# Altium schematic sheet port.SchDoc
size A4
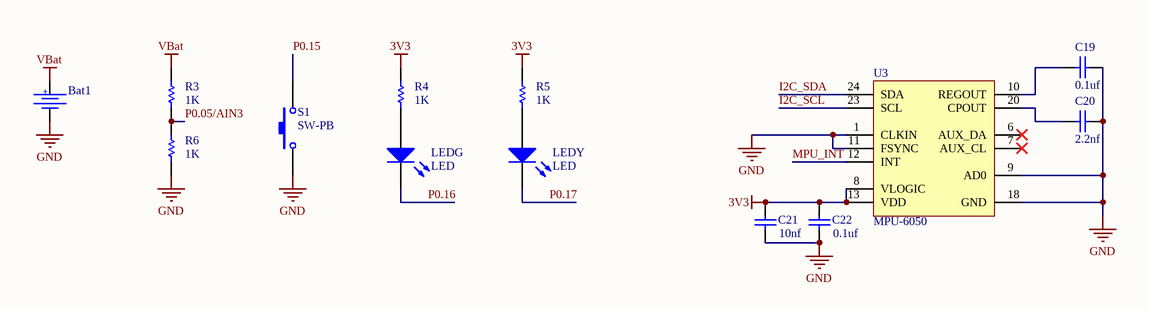
[diagram p0: port.SchDoc]

## Parts
Bat1  Bat Holder CR2032  [HDR1X2]  (value not drawn)
C19  value 0.1uf  [C0603]  (hidden comment: Cap Semi)
C20  value 2.2nf  [C0603]  (hidden comment: Cap Semi)
C21  value 10nf  [C0603]  (hidden comment: Cap Semi)
C22  value 0.1uf  [C0603]  (hidden comment: Cap Semi)
LEDG  LED  [0603]
LEDY  LED  [0603]
R3  value 1K  [R0603-M]  (hidden comment: Resistors SMD)
R4  value 1K  [R0603-M]  (hidden comment: Resistors SMD)
R5  value 1K  [R0603-M]  (hidden comment: Resistors SMD)
R6  value 1K  [R0603-M]  (hidden comment: Resistors SMD)
S1  SW-PB  [SWITCH_SMD_4x3_DHT-1185]
U3  MPU-6050  [MPU-6050]

## Nets
3V3: C21.2 C22.2 R4.2 R5.2 U3.8(VLOGIC) U3.13(VDD)
GND: Bat1.2 C19.1 C20.1 C21.1 C22.1 R6.1 S1.1 U3.1(CLKIN) U3.9(AD0) U3.11(FSYNC) U3.18(GND)
VBat: Bat1.1 R3.2
I2C_SCL: U3.23(SCL)
I2C_SDA: U3.24(SDA)
MPU_INT: U3.12(INT)
P0.05/AIN3: R3.1 R6.2
P0.15: S1.2
P0.16: LEDG.2(K)
P0.17: LEDY.2(K)
NetC19_2: C19.2 U3.10(REGOUT)
NetC20_2: C20.2 U3.20(CPOUT)
NetLEDG_1: LEDG.1(A) R4.1
NetLEDY_1: LEDY.1(A) R5.1

Not connected (* = marked no-connect by the designer): U3 6(AUX_DA)* 7(AUX_CL)*

## Notes on the sheet
- (in symbol Battery) +

## Library data of the parts
Bat1 = Battery: Bat Holder CR2032 SMD; Manufacturer: Comfortable; Manufacturer Part Number: BC-2001; 2nd source part number: 165-0693; Artikkelnr Noca: 55089011; Artikkelnr Simpro: N.A.; Part Number: Bat Holder CR2032 SMD; Datasheet: \\hizz\pro\app9717\Datasheet\connectores\Comfortable\BC-2001.pdf; Footprint Doc: CR2032_HOLDER_SMD; LatestRevisionDate: 2016-04-21; Pin Count: 3; Publisher: Nordic Semiconductor; Published: 2009-12-12; Value: Bat Holder CR2032; Note: Bat Holder CR2032; Supplier: Cabcon; Supplier part number: BC-2001/T & R; 2nd source Supplier: Farnell
C19-C22 = Cap Semi: Capacitor (Semiconductor SIM Model); Published: 8-Jun-2000; LatestRevisionDate: 29-May-2009; LatestRevisionNote: IPC-7351 Footprint Added.; PackageReference: C1206; Publisher: Altium Limited; PackageDescription: Chip Capacitor
LEDG LEDY = LED: Typical INFRARED GaAs LED; Published: 8-Jun-2000; LatestRevisionDate: 08-Jul-2005; LatestRevisionNote: Mech Layer 1 removed.; PackageReference: LED-0; Publisher: Altium Limited; PackageDescription: LED; 2 Leads
R3-R6 = Resistors SMD: Resistor
S1 = SW-PB: Switch; Published: 24-Mar-1999; LatestRevisionDate: 17-Jul-2002; LatestRevisionNote: Re-released for DXP Platform.; PackageReference: SPST-2; Publisher: Altium Limited; PackageDescription: Switch; 2 Leads